# Altium project GarageBeamSafety.PrjPcb
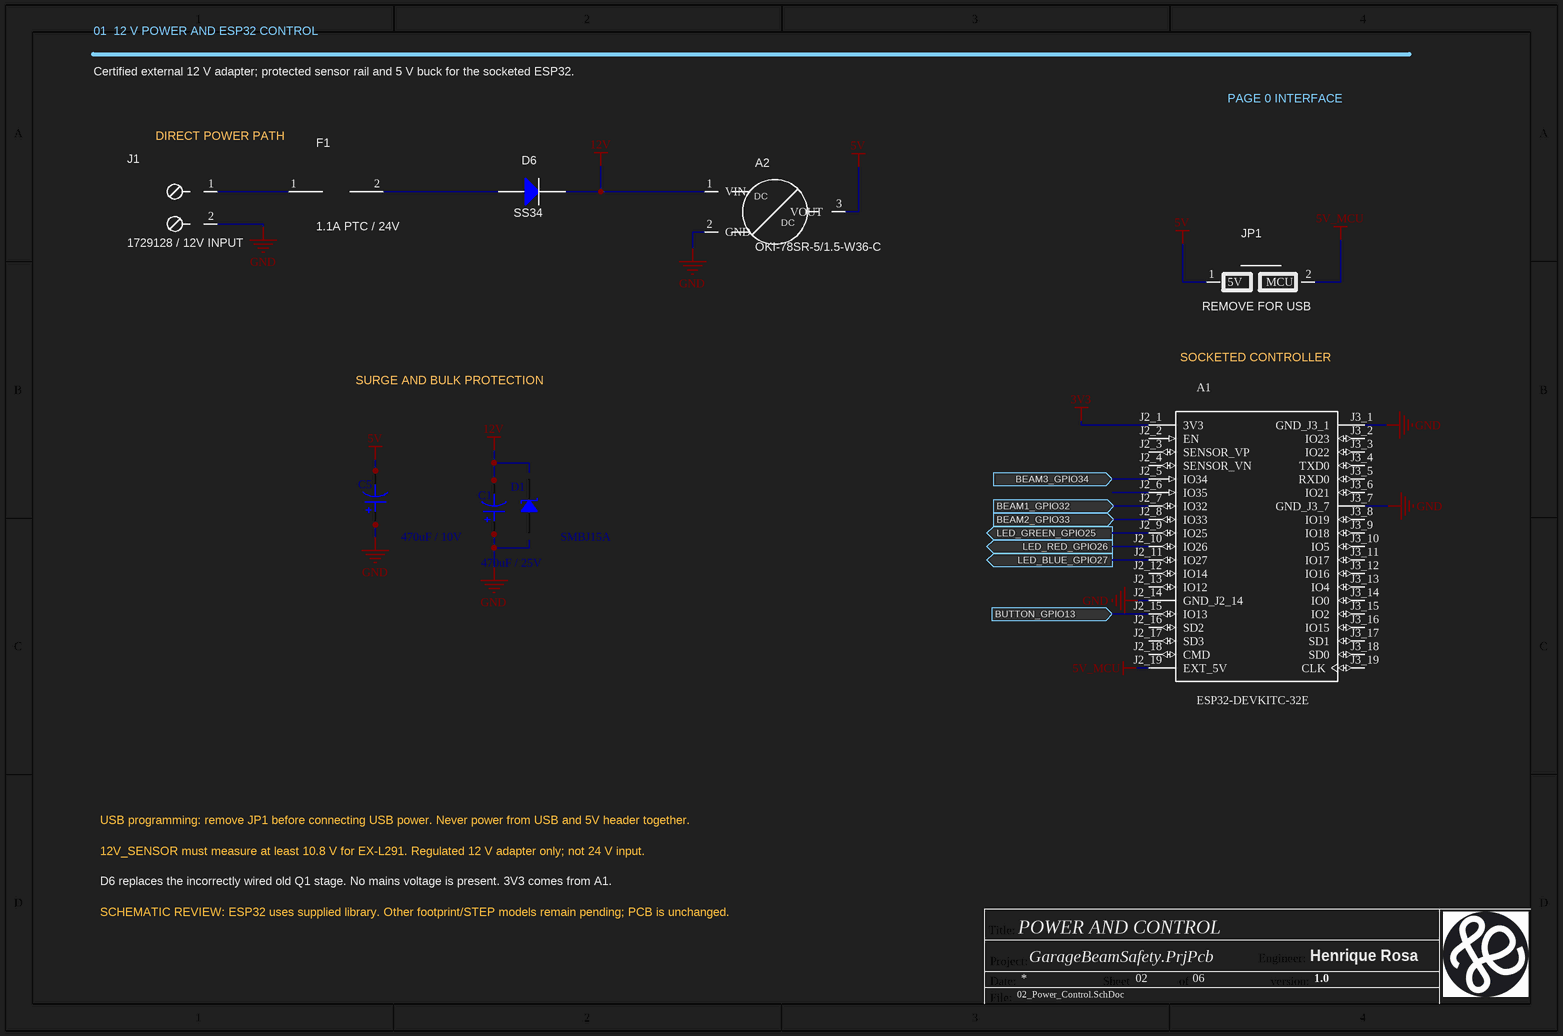
[diagram p0: 02_Power_Control.SchDoc]
4 sheets, 53 parts. Net scope: flat (ports and power ports of the same name join across sheets).
Board file: GarageBeamSafety.PcbDoc
Sheets:
  02_Power_Control.SchDoc
  01_System_Overview.SchDoc
    Designator = 03_Beam_Inputs.SchDoc
  05_Optical_Heads.SchDoc

## Sheet 02_Power_Control.SchDoc: POWER AND CONTROL
size A4; Author: Henrique Rosa; DrawnBy: Henq / Codex; Engineer: Henrique Rosa; Address1: rua; Address: Bairro; Address3: São Paulo, SP - Brasil; Address4: 55 (11) 9 6825-6715; DocumentNumber: GBS-01; Revision: 1.0; SheetNumber: 02; SheetTotal: 06; Site: henq.com; VersionControl_RevNumber: 03; PageSetup: Record=PageOptions|CenterHorizontal=True|CenterVertical=True|PrintScale=0.98|XCorrection=1.00|YCorrection=1.00|PrintKind=0|BorderSize=5000000|LeftOffset=0|BottomOffset=0|Orientation=2|PaperLength=1000|PaperWidth=1000|Scale=100|PaperSource=7|PrintQuality=-3|MediaType=1|DitherType=10|PrintScaleMode=1|PaperKind=A4|PaperIndex=9

### Parts
A1  ESP32-DEVKITC-32E  [MODULE_ESP32-DEVKITC-32E]
A2  OKI-78SR-5/1.5-W36-C  [MURATA_OKI78SR_VERTICAL]
C1  470uF / 25V  [PANASONIC_EEUFR1E471_D10_P5]
C5  470uF / 10V  [PANASONIC_EEUFR1A471_D8_P3_5]
D1  SMBJ15A  [SMBJ15A_A1_K2]
D6  SS34  [SS34_A1_K2]
F1  1.1A PTC / 24V  [BOURNS_MFMSMF110_24X_STYLE2]
J1  1729128 / 12V INPUT  [PHOENIX_1729128_MKDSN_2_508]
JP1  REMOVE FOR USB  [SAMTEC_TSW102_07_SINGLE]

### Ports
BEAM1_GPIO32 (in), BEAM2_GPIO33 (in), BEAM3_GPIO34 (in), BUTTON_GPIO13 (in), LED_BLUE_GPIO27 (out), LED_GREEN_GPIO25 (out), LED_RED_GPIO26 (out)

### Nets
3V3: A1.J2_1(3V3)
5V: A2.3(VOUT) C5.2 JP1.1(5V)
5V_MCU: A1.J2_19(EXT_5V) JP1.2(MCU)
12V: A2.1(VIN) C1.2 D6.2(K)
GND: A1.J2_14(GND_J2_14) A1.J3_1(GND_J3_1) A1.J3_7(GND_J3_7) A2.2(GND) C1.1 C5.1 J1.2(0V)
NetA1_J2_5: A1.J2_5(IO34) ; port BEAM3_GPIO34
NetA1_J2_7: A1.J2_7(IO32) ; port BEAM1_GPIO32
NetA1_J2_8: A1.J2_8(IO33) ; port BEAM2_GPIO33
NetA1_J2_9: A1.J2_9(IO25) ; port LED_GREEN_GPIO25
NetA1_J2_10: A1.J2_10(IO26) ; port LED_RED_GPIO26
NetA1_J2_11: A1.J2_11(IO27) ; port LED_BLUE_GPIO27
NetA1_J2_15: A1.J2_15(IO13) ; port BUTTON_GPIO13
NetD6_1: D6.1(A) F1.2
NetF1_1: F1.1 J1.1(+12V)

Not connected (* = marked no-connect by the designer): A1 J2_2(EN) J2_3(SENSOR_VP) J2_4(SENSOR_VN) J2_6(IO35) J2_12(IO14) J2_13(IO12) J2_16(SD2) J2_17(SD3) J2_18(CMD) J3_2(IO23) J3_3(IO22) J3_4(TXD0) J3_5(RXD0) J3_6(IO21) J3_8(IO19) J3_9(IO18) J3_10(IO5) J3_11(IO17) J3_12(IO16) J3_13(IO4) J3_14(IO0) J3_15(IO2) J3_16(IO15) J3_17(SD1) J3_18(SD0) J3_19(CLK); D1 1 2

### Notes on the sheet
- 01  12 V POWER AND ESP32 CONTROL
- Certified external 12 V adapter; protected sensor rail and 5 V buck for the socketed ESP32.
- PAGE 0 INTERFACE
- DIRECT POWER PATH
- SURGE AND BULK PROTECTION
- SOCKETED CONTROLLER
- USB programming: remove JP1 before connecting USB power. Never power from USB and 5V header together.
- 12V_SENSOR must measure at least 10.8 V for EX-L291. Regulated 12 V adapter only; not 24 V input.
- D6 replaces the incorrectly wired old Q1 stage. No mains voltage is present. 3V3 comes from A1.
- SCHEMATIC REVIEW: ESP32 uses supplied library. Other footprint/STEP models remain pending; PCB is unchanged.
- Title:
- Project:
- Date:
- Sheet
- of
- Engineer:
- version:
- File:
- Title
- Size:
- A4
- Number:
- Time:
- Revision:
- (in symbol *) DC

### Library data of the parts
A1 = ESP32-DEVKITC-32E: The ESP32-DEVKITC-32E transceiver evaluation board from Espressif Systems is a powerful development tool for wireless communication technologies. It supports 802.11 b/g/n Wi-Fi and BluetoothÂ® Smart Ready 4.x (BLE) dual-mode at 2.4GHz, making it ideal for; CAD status: Reusable reviewed symbol; pin/pad check performed by refresh. Native ERC, PCB ECO and 3D mechanical inspection still required.; Component refresh: 2026-09-10 sourced-symbol pass; not manufacturing release; Symbol adaptation: Keep existing part-specific symbol; package and procurement metadata retained.; SnapEDA_Link: https://www.snapeda.com/parts/ESP32-DEVKITC-32E/Espressif+Systems/view-part/?ref=snap; Package: None; Value: ESP32-DevKitC-32E; MF: Espressif Systems; MP: ESP32-DEVKITC-32E; Check_prices: https://www.snapeda.com/parts/ESP32-DEVKITC-32E/Espressif+Systems/view-part/?ref=eda; Manufacturer: Espressif Systems; Manufacturer Part Number: ESP32-DevKitC-32E; Part Number: ESP32-DevKitC-32E; Intended footprint: MODULE_ESP32-DEVKITC-32E
A2 = *: 12 V to regulated 5 V DC/DC module; Manufacturer: Murata; Populate: Yes; CAD status: Reusable reviewed symbol; pin/pad check performed by refresh. Native ERC, PCB ECO and 3D mechanical inspection still required.; Symbol provenance: Project-authored native Altium library; based on identified manufacturer part and pinout, not vendor-issued CAD; Component refresh: 2026-09-10 sourced-symbol pass; not manufacturing release; Symbol adaptation: Keep existing part-specific symbol; package and procurement metadata retained.; Manufacturer Part Number: OKI-78SR-5/1.5-W36-C; Package: SIP3_BUCK; Intended footprint: MURATA_OKI78SR_VERTICAL; Datasheet: https://www.murata.com/products/productdata/8807037992990/oki-78sr.pdf; Part Number: OKI-78SR-5/1.5-W36-C; Value: OKI-78SR-5/1.5-W36-C
C1 = Polarised Capacitor: SMT Polarised Capacitor; Part Number: EEU-FR1E471; Manufacturer: Panasonic; Polarity: Pin 1 positive; pin 2 negative; Symbol source: Celestial / SCH - PASSIVES - POLARISED CAPACITOR.SCHLIB / Polarised Capacitor; CAD status: Complete native symbol loaded; repair COPY requires visual and compiled connectivity validation; Valor: 470uF / 25V; Manufacturer Part Number: EEU-FR1E471; Intended footprint: PANASONIC_EEUFR1E471_D10_P5; Footprint source: Local PinRepairFootprints.PcbLib; source and polarity checked; Value: 470uF / 25V
C5 = Polarised Capacitor: SMT Polarised Capacitor; Part Number: EEU-FR1A471; Manufacturer: Panasonic; Polarity: Pin 1 positive; pin 2 negative; Symbol source: Celestial / SCH - PASSIVES - POLARISED CAPACITOR.SCHLIB / Polarised Capacitor; CAD status: Complete native symbol loaded; repair COPY requires visual and compiled connectivity validation; Valor: 470uF / 10V; Manufacturer Part Number: EEU-FR1A471; Intended footprint: PANASONIC_EEUFR1A471_D8_P3_5; Footprint source: Local PinRepairFootprints.PcbLib; source and polarity checked; Value: 470uF / 10V
D1 = DIODE TVS UNI: Rectifier Diode; Manufacturer: Littelfuse; Symbol source: Celestial / SCH - DIODES - DIODE TVS UNI.SCHLIB / DIODE TVS UNI; CAD status: Complete native symbol loaded; repair COPY requires visual and compiled connectivity validation; Value: SMBJ15A; Part Number: SMBJ15A; Manufacturer Part Number: SMBJ15A; Intended footprint: SMBJ15A_A1_K2; Footprint source: Local PinRepairFootprints.PcbLib; source and polarity checked
D6 = Diode: Series reverse-polarity Schottky diode; Manufacturer: Vishay; Value: SS34-E3/57T; Symbol source: Conventional symbol reused from ENERGY.SchDoc; CAD status: Reusable reviewed symbol; pin/pad check performed by refresh. Native ERC, PCB ECO and 3D mechanical inspection still required.; Component refresh: 2026-09-10 sourced-symbol pass; not manufacturing release; Symbol adaptation: Retain existing diode symbol for SS34; dedicated Schottky glyph remains a follow-up (not silently replaced with TVS/rectifier artwork).; Part Number: SS34-E3/57T; Manufacturer Part Number: SS34-E3/57T; Intended footprint: SS34_A1_K2; Footprint source: Local PinRepairFootprints.PcbLib; source and polarity checked
F1 = *: Resettable 12 V input fuse; Manufacturer: Bourns; Manufacturer Part Number: MF-MSMF110/24X-2; Populate: Yes; CAD status: Reusable reviewed symbol; pin/pad check performed by refresh. Native ERC, PCB ECO and 3D mechanical inspection still required.; Value: MF-MSMF110/24X-2; Component refresh: 2026-09-10 sourced-symbol pass; not manufacturing release; Symbol source: Celestial / Mark Harris / SCH - PASSIVES - THERMISTOR PTC.SCHLIB / Thermistor PTC; Symbol adaptation: Import Celestial symbol artwork; retain physical pin identities and positions; lead extensions adapt the symbol to existing wiring.; Package: F1812; Intended footprint: BOURNS_MFMSMF110_24X_STYLE2; Footprint source: Local PinRepairFootprints.PcbLib; source and polarity checked; Part Number: MF-MSMF110/24X-2; Voltage rating: 24 V
J1 = *: Two-position 5.08 mm screw terminal; Manufacturer: Phoenix Contact; Populate: Yes; CAD status: Reusable reviewed symbol; pin/pad check performed by refresh. Native ERC, PCB ECO and 3D mechanical inspection still required.; Symbol provenance: Project-authored native Altium library; based on identified manufacturer part and pinout, not vendor-issued CAD; Component refresh: 2026-09-10 sourced-symbol pass; not manufacturing release; Symbol adaptation: Keep existing part-specific symbol; package and procurement metadata retained.; Manufacturer Part Number: 1729128; Package: TERM_2_508; Intended footprint: PHOENIX_1729128_MKDSN_2_508; Part Number: 1729128; Value: 1729128
JP1 = *: External 5 V disconnect; fit shunt only without USB; Manufacturer: Samtec; Manufacturer Part Number: TSW-102-07-G-S; Populate: Yes; CAD status: Reusable reviewed symbol; pin/pad check performed by refresh. Native ERC, PCB ECO and 3D mechanical inspection still required.; Value: TSW-102-07-G-S; Component refresh: 2026-09-10 sourced-symbol pass; not manufacturing release; Symbol adaptation: Keep existing part-specific symbol; package and procurement metadata retained.; Package: HEADER_1X02_2.54; Intended footprint: SAMTEC_TSW102_07_SINGLE; Footprint source: Local PinRepairFootprints.PcbLib; source and polarity checked; Part Number: TSW-102-07-G-S

## Sheet 01_System_Overview.SchDoc: SYSTEM HIERARCHY
size A4; Author: Henrique Rosa; DrawnBy: Henq / Codex; Engineer: Henrique Rosa; Address1: rua; Address: Bairro; Address3: São Paulo, SP - Brasil; Address4: 55 (11) 9 6825-6715; DocumentNumber: GBS-00; Revision: A; SheetNumber: 01; SheetTotal: 06; Site: henq.com; VersionControl_RevNumber: 03; PageSetup: Record=PageOptions|CenterHorizontal=True|CenterVertical=True|PrintScale=0.98|XCorrection=1.00|YCorrection=1.00|PrintKind=0|BorderSize=5000000|LeftOffset=0|BottomOffset=0|Orientation=2|PaperLength=1000|PaperWidth=1000|Scale=100|PaperSource=7|PrintQuality=-3|MediaType=1|DitherType=10|PrintScaleMode=1|PaperKind=A4|PaperIndex=9
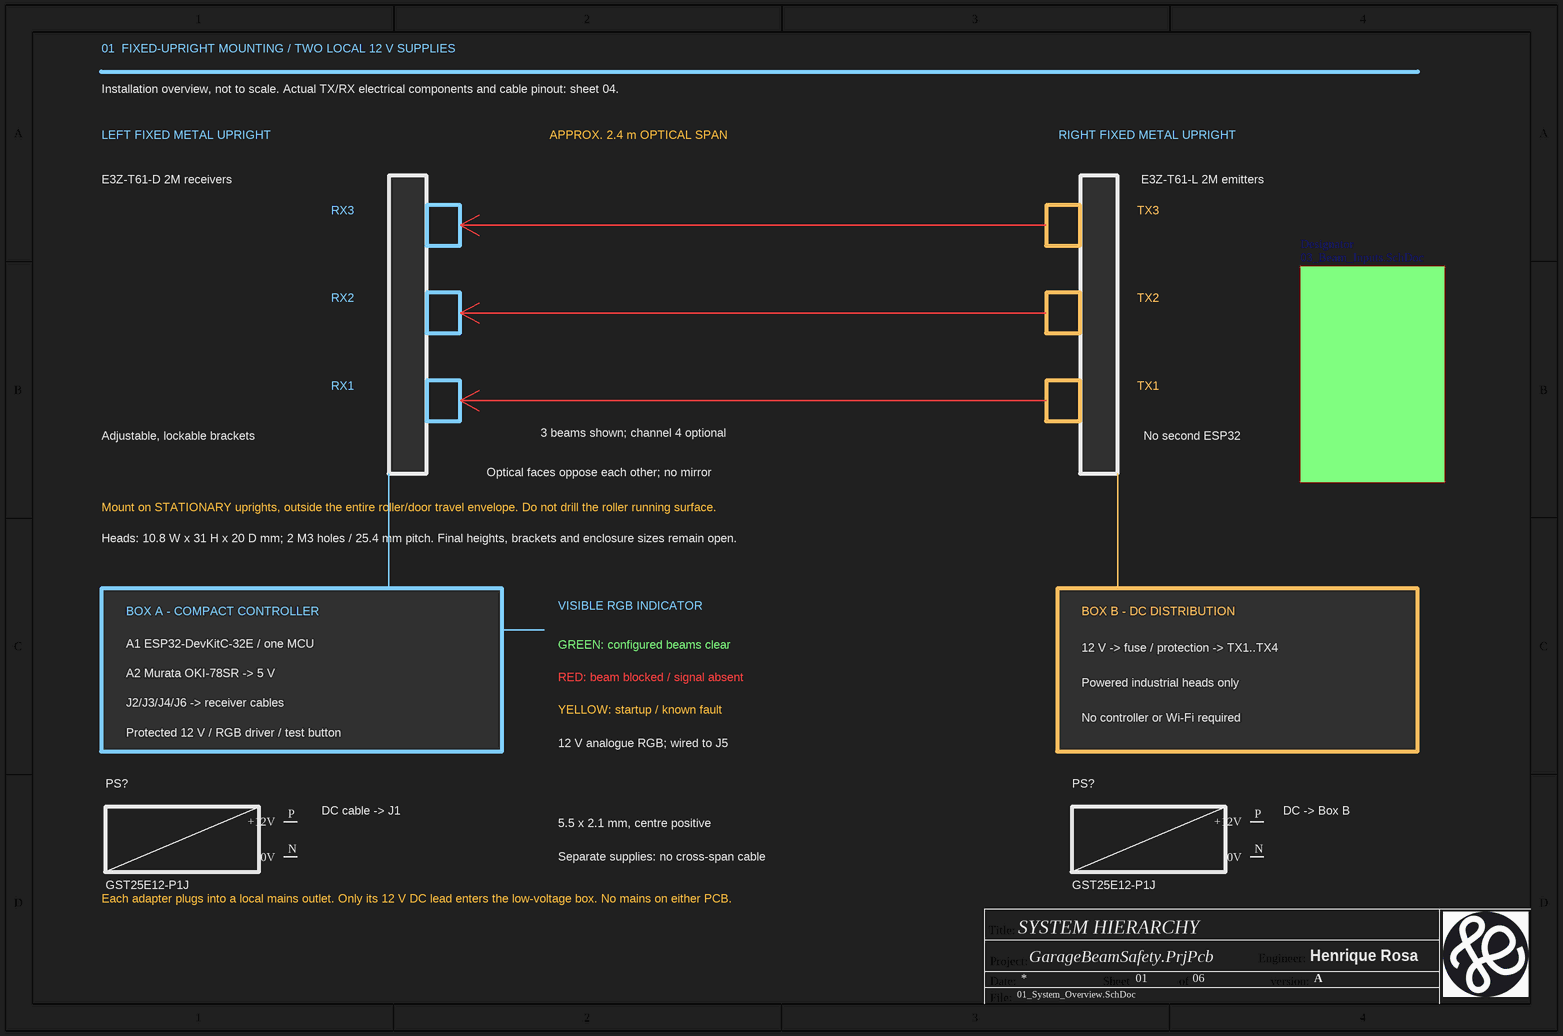
[diagram p1: 01_System_Overview.SchDoc]

### Parts
(Parts that share a designator on the sheet are numbered #1, #2 ... from top to bottom, then left to right.)
PS?#1  GST25E12-P1J  (graphical)
PS?#2  GST25E12-P1J  (graphical)

### Sub-sheets
Designator = 03_Beam_Inputs.SchDoc: no entries

### Nets

Not connected (* = marked no-connect by the designer): PS?#1 N(0V) P(+12V); PS?#2 N(0V) P(+12V)

### Notes on the sheet
- 01  FIXED-UPRIGHT MOUNTING / TWO LOCAL 12 V SUPPLIES
- Installation overview, not to scale. Actual TX/RX electrical components and cable pinout: sheet 04.
- LEFT FIXED METAL UPRIGHT
- APPROX. 2.4 m OPTICAL SPAN
- RIGHT FIXED METAL UPRIGHT
- E3Z-T61-D 2M receivers
- RX3
- TX3
- E3Z-T61-L 2M emitters
- RX2
- TX2
- Adjustable, lockable brackets
- RX1
- 3 beams shown; channel 4 optional
- TX1
- No second ESP32
- Mount on STATIONARY uprights, outside the entire roller/door travel envelope. Do not drill the roller running surface.
- Optical faces oppose each other; no mirror
- Heads: 10.8 W x 31 H x 20 D mm; 2 M3 holes / 25.4 mm pitch. Final heights, brackets and enclosure sizes remain open.
- BOX A - COMPACT CONTROLLER
- A1 ESP32-DevKitC-32E / one MCU
- VISIBLE RGB INDICATOR
- GREEN: configured beams clear
- BOX B - DC DISTRIBUTION
- 12 V -> fuse / protection -> TX1..TX4
- A2 Murata OKI-78SR -> 5 V
- J2/J3/J4/J6 -> receiver cables
- RED: beam blocked / signal absent
- YELLOW: startup / known fault
- Powered industrial heads only
- No controller or Wi-Fi required
- Protected 12 V / RGB driver / test button
- 12 V analogue RGB; wired to J5
- (near PS?#1) DC cable -> J1
- 5.5 x 2.1 mm, centre positive
- (near PS?#2) DC -> Box B
- (near PS?#1) Each adapter plugs into a local mains outlet. Only its 12 V DC lead enters the low-voltage box. No mains on either PCB.
- Separate supplies: no cross-span cable
- Title:
- Project:
- Date:
- Sheet
- of
- Engineer:
- version:
- File:
- Title
- Size:
- A4
- Number:
- Time:
- Revision:

### Library data of the parts
PS?#1 PS?#2 = *: Intact certified AC/DC adapter, 12 V 2.08 A; Manufacturer: MEAN WELL; Populate: Yes; Intended footprint: NONE - external plug-in adapter; CAD status: External equipment symbol: no controller-PCB pads; mechanical CAD remains unverified.; DC connector: 5.5 x 2.1 mm centre positive; keep adapter intact; Assembly location: External installation; not mounted on controller PCB; Procurement list: docs/PIN_REPAIR.html - external hardware; Component refresh: 2026-09-10 sourced-symbol pass; not manufacturing release; Symbol adaptation: Keep existing part-specific symbol; package and procurement metadata retained. External equipment: deliberately no PCB footprint. Manufacturer mechanical CAD remains separate/unverified.; Manufacturer Part Number: GST25E12-P1J; Package: EXTERNAL EQUIPMENT; Datasheet: https://www.meanwell.com/Upload/PDF/GST25E/GST25E-SPEC.PDF; Part Number: GST25E12-P1J; Value: GST25E12-P1J

## Sheet 03_Beam_Inputs.SchDoc: BEAM INPUTS
size A4; Author: Henrique Rosa; DrawnBy: Henq / Codex; Engineer: Henrique Rosa; Address1: rua; Address: Bairro; Address3: São Paulo, SP - Brasil; Address4: 55 (11) 9 6825-6715; DocumentNumber: GBS-02; Revision: A; SheetNumber: 03; SheetTotal: 06; Site: henq.com; VersionControl_RevNumber: 03; PageSetup: Record=PageOptions|CenterHorizontal=True|CenterVertical=True|PrintScale=0.98|XCorrection=1.00|YCorrection=1.00|PrintKind=0|BorderSize=5000000|LeftOffset=0|BottomOffset=0|Orientation=2|PaperLength=1000|PaperWidth=1000|Scale=100|PaperSource=7|PrintQuality=-3|MediaType=1|DitherType=10|PrintScaleMode=1|PaperKind=A4|PaperIndex=9
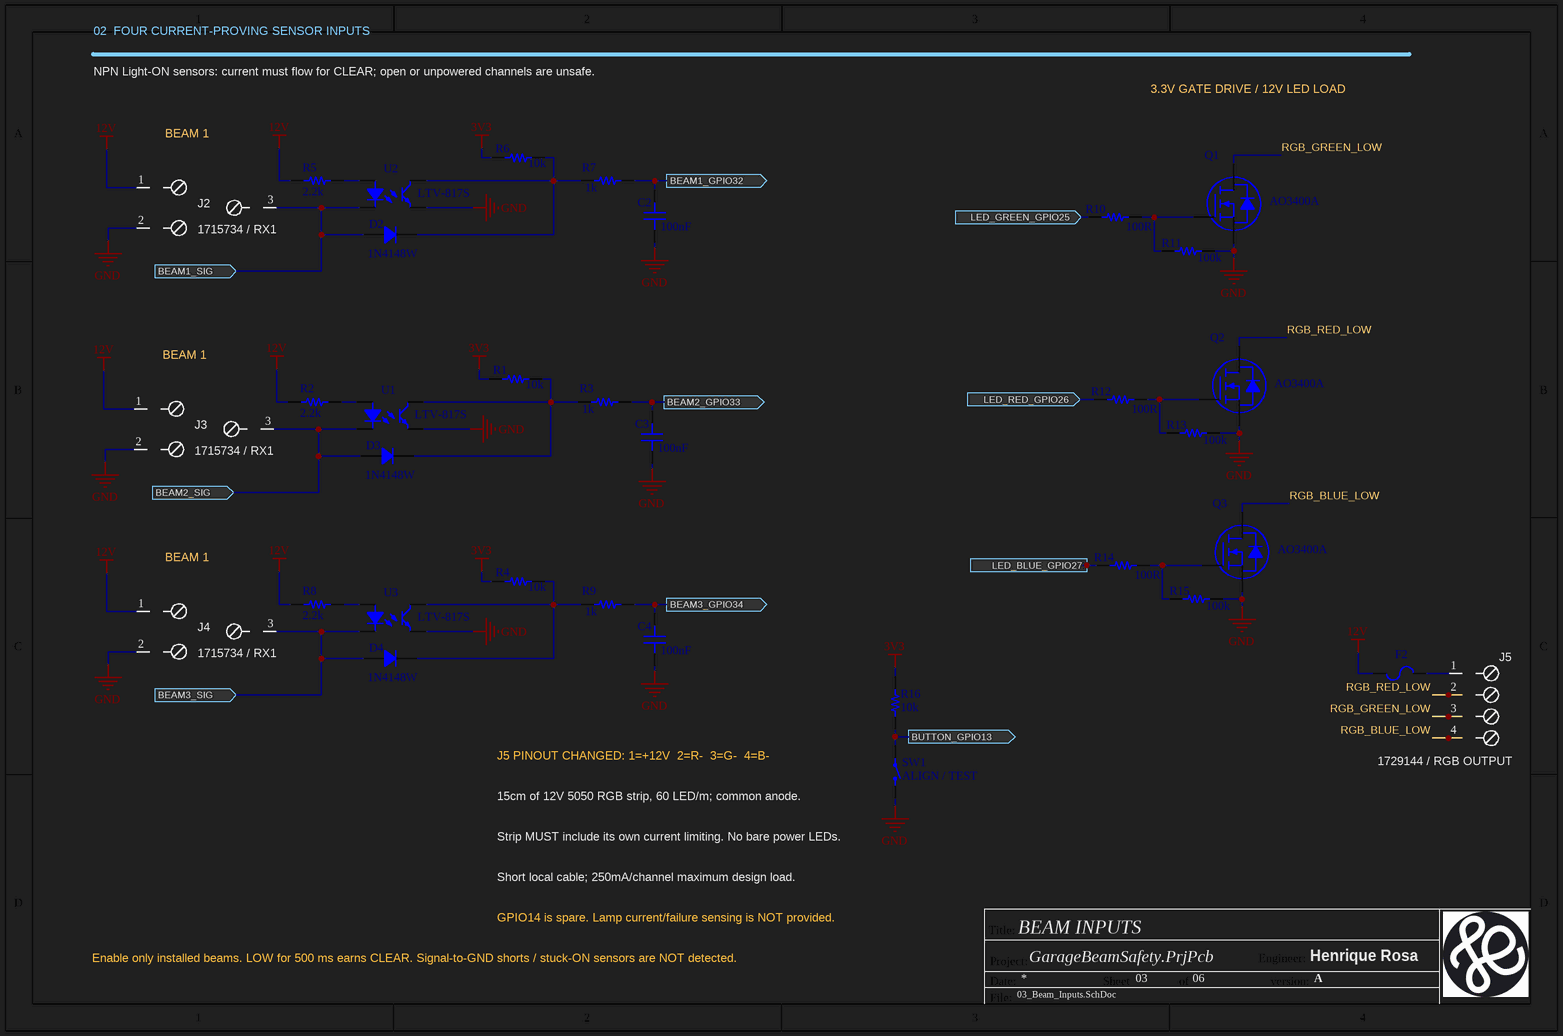
[diagram p2: 03_Beam_Inputs.SchDoc]

### Parts
C2  100nF  [MURATA GRM21B 0805_2012]
C3  100nF  [MURATA GRM21B 0805_2012]
C4  100nF  [MURATA GRM21B 0805_2012]
D2  1N4148W  [1N4148W_SOD123_A1_K2]
D3  1N4148W  [1N4148W_SOD123_A1_K2]
D4  1N4148W  [1N4148W_SOD123_A1_K2]
F2  0.5A FAST  [LITTELFUSE_0451_2410]  (value not drawn)
J2  1715734 / RX1  [PHOENIX_1715734_MKDS_3_508]
J3  1715734 / RX1  [PHOENIX_1715734_MKDS_3_508]
J4  1715734 / RX1  [PHOENIX_1715734_MKDS_3_508]
J5  1729144 / RGB OUTPUT  [PHOENIX_1729144_MKDSN_4_508]
Q1  AO3400A  [AO3400A_G1_S2_D3]
Q2  AO3400A  [AO3400A_G1_S2_D3]
Q3  AO3400A  [AO3400A_G1_S2_D3]
R1  10k  [YAGEO RES 0805_2012]
R2  2.2k  [YAGEO RES 0805_2012]
R3  1k  [YAGEO RES 0805_2012]
R4  10k  [YAGEO RES 0805_2012]
R5  2.2k  [YAGEO RES 0805_2012]
R6  10k  [YAGEO RES 0805_2012]
R7  1k  [YAGEO RES 0805_2012]
R8  2.2k  [YAGEO RES 0805_2012]
R9  1k  [YAGEO RES 0805_2012]
R10  100R  [YAGEO RES 0805_2012]
R11  100k  [YAGEO RES 0805_2012]
R12  100R  [YAGEO RES 0805_2012]
R13  100k  [YAGEO RES 0805_2012]
R14  100R  [YAGEO RES 0805_2012]
R15  100k  [YAGEO RES 0805_2012]
R16  10k  [YAGEO RES 0805_2012]
SW1  ALIGN / TEST  [OMRON_B3FS1000P_LOGICAL_1_2]
U1  LTV-817S  [LITEON LTV-817]
U2  LTV-817S  [LITEON LTV-817]
U3  LTV-817S  [LITEON LTV-817]

### Ports
BEAM1_GPIO32 (out), BEAM1_SIG (in), BEAM2_GPIO33 (out), BEAM2_SIG (in), BEAM3_GPIO34 (out), BEAM3_SIG (in), BUTTON_GPIO13 (out), LED_BLUE_GPIO27 (in), LED_GREEN_GPIO25 (in), LED_RED_GPIO26 (in)

### Nets
3V3: R1.1 R4.1 R6.1 R16.1
12V: F2.1 J2.1(+12V) J3.1(+12V) J4.1(+12V) R2.1 R5.1 R8.1
GND: C2.1 C3.1 C4.1 J2.2(0V) J3.2(0V) J4.2(0V) Q1.2(S) Q2.2(S) Q3.2(S) R11.2 R13.2 R15.2 SW1.2 U1.3 U2.3 U3.3
BEAM1_SIG: D2.1 J2.3(OUT) U2.2 ; port BEAM1_SIG
BEAM2_SIG: D3.1 J3.3(OUT) U1.2 ; port BEAM2_SIG
BEAM3_SIG: D4.1 J4.3(OUT) U3.2 ; port BEAM3_SIG
RGB_BLUE_LOW: J5.4(B-) Q3.3(D)
RGB_GREEN_LOW: J5.3(G-) Q1.3(D)
RGB_RED_LOW: J5.2(R-) Q2.3(D)
NetA1_J2_5: C4.2 R9.2 ; port BEAM3_GPIO34
NetA1_J2_7: C2.2 R7.2 ; port BEAM1_GPIO32
NetA1_J2_8: C3.2 R3.2 ; port BEAM2_GPIO33
NetA1_J2_9: R10.1 ; port LED_GREEN_GPIO25
NetA1_J2_10: R12.1 ; port LED_RED_GPIO26
NetA1_J2_11: R14.1 ; port LED_BLUE_GPIO27
NetA1_J2_15: R16.2 SW1.1 ; port BUTTON_GPIO13
NetD2_2: D2.2 R6.2 R7.1 U2.4
NetD3_2: D3.2 R1.2 R3.1 U1.4
NetD4_2: D4.2 R4.2 R9.1 U3.4
NetF2_2: F2.2 J5.1(+12V)
NetQ1_1: Q1.1(G) R10.2 R11.1
NetQ2_1: Q2.1(G) R12.2 R13.1
NetQ3_1: Q3.1(G) R14.2 R15.1
NetR2_2: R2.2 U1.1
NetR5_2: R5.2 U2.1
NetR8_2: R8.2 U3.1

### Notes on the sheet
- 02  FOUR CURRENT-PROVING SENSOR INPUTS
- NPN Light-ON sensors: current must flow for CLEAR; open or unpowered channels are unsafe.
- 3.3V GATE DRIVE / 12V LED LOAD
- (near J2) BEAM 1
- (near J3) BEAM 1
- (near J4) BEAM 1
- J5 PINOUT CHANGED: 1=+12V  2=R-  3=G-  4=B-
- 15cm of 12V 5050 RGB strip, 60 LED/m; common anode.
- (near SW1) Strip MUST include its own current limiting. No bare power LEDs.
- Short local cable; 250mA/channel maximum design load.
- GPIO14 is spare. Lamp current/failure sensing is NOT provided.
- Enable only installed beams. LOW for 500 ms earns CLEAR. Signal-to-GND shorts / stuck-ON sensors are NOT detected.
- Title:
- Project:
- Date:
- Sheet
- of
- Engineer:
- version:
- File:
- Title
- Size:
- A4
- Number:
- Time:
- Revision:

### Library data of the parts
C2-C4 = Capacitor: SMT Capacitor; Part Number: GRM21BR71H104KA01L; Manufacturer: Murata; Symbol source: Celestial / SCH - PASSIVES - CAPACITOR.SCHLIB / Capacitor; CAD status: Complete native symbol loaded; repair COPY requires visual and compiled connectivity validation; Valor: 100nF; Manufacturer Part Number: GRM21BR71H104KA01L; Intended footprint: MURATA GRM21B 0805_2012; Footprint source: Celestial Altium Library / Mark Harris / https://altiumlibrary.com; Value: 100nF
D2-D4 = Diode: Rectifier Diode; Manufacturer: Nexperia; Symbol source: Celestial / SCH - DIODES - DIODE.SCHLIB / Diode; CAD status: Complete native symbol loaded; repair COPY requires visual and compiled connectivity validation; Value: 1N4148W; Part Number: 1N4148W; Manufacturer Part Number: 1N4148W; Intended footprint: 1N4148W_SOD123_A1_K2; Footprint source: Local PinRepairFootprints.PcbLib; source and polarity checked
F2 = MOUNTED FUSE: GENERIC_fuse; Manufacturer: Littelfuse; Manufacturer Part Number: 0451.500MRL; Populate: Yes; Value: 0451.500MRL; Symbol source: Celestial / SCH - FUSE - MOUNTED FUSE.Schlib / MOUNTED FUSE; CAD status: Complete native symbol loaded; repair COPY requires visual and compiled connectivity validation; Package: FUSE_2410; Intended footprint: LITTELFUSE_0451_2410; Footprint source: Local PinRepairFootprints.PcbLib; source and polarity checked; Part Number: 0451.500MRL
J2-J4 = *: 12V / GND / NPN signal terminal; Manufacturer: Phoenix Contact; Populate: Yes; CAD status: Reusable reviewed symbol; pin/pad check performed by refresh. Native ERC, PCB ECO and 3D mechanical inspection still required.; Wiring: 1 brown +12V; 2 blue 0V; 3 black NPN output; Symbol provenance: Project-authored native Altium library; based on identified manufacturer part and pinout, not vendor-issued CAD; Component refresh: 2026-09-10 sourced-symbol pass; not manufacturing release; Symbol adaptation: Keep existing part-specific symbol; package and procurement metadata retained.; Manufacturer Part Number: 1715734; Package: MKDS 1,5/3-5,08; Intended footprint: PHOENIX_1715734_MKDS_3_508; Datasheet: https://www.phoenixcontact.com/en-us/products/printed-circuit-board-terminal-mkds-15-3-508-1715734; Part Number: 1715734; Value: 1715734
J5 = *: Common-anode analogue RGB strip; NOT addressable; Manufacturer: Phoenix Contact; Populate: Yes; CAD status: Reusable reviewed symbol; pin/pad check performed by refresh. Native ERC, PCB ECO and 3D mechanical inspection still required.; Symbol provenance: Project-authored native Altium library; based on identified manufacturer part and pinout, not vendor-issued CAD; Component refresh: 2026-09-10 sourced-symbol pass; not manufacturing release; Symbol adaptation: Keep existing part-specific symbol; package and procurement metadata retained.; Manufacturer Part Number: 1729144; Package: TERM_4_508; Intended footprint: PHOENIX_1729144_MKDSN_4_508; Part Number: 1729144; Value: 1729144
Q1-Q3 = MOSFET SINGLE GDS: Manufacturer: Alpha and Omega Semiconductor; Populate: Yes; 3D asset: lib/upstream-kicad/SOT-23.step; downloaded, native link pending; Symbol source: Celestial / SCH - FET - N-CH - MOSFET SINGLE GDS.SCHLIB / MOSFET SINGLE GDS; CAD status: Complete native symbol loaded; repair COPY requires visual and compiled connectivity validation; Manufacturer Part Number: AO3400A; Package: Package_TO_SOT_SMD:SOT-23; Intended footprint: AO3400A_G1_S2_D3; Datasheet: https://www.aosmd.com/sites/default/files/res/datasheets/AO3400A.pdf; Footprint source: Local PinRepairFootprints.PcbLib; source and polarity checked; Part Number: AO3400A; Value: AO3400A
R1 R4 R6 R16 = Resistor: SMT Resistor; Part number: RC0805FR-0710KL; Manufacturer: Yageo; Symbol source: Celestial / SCH - PASSIVES - RESISTOR.SCHLIB / Resistor; CAD status: Complete native symbol loaded; repair COPY requires visual and compiled connectivity validation; Valor: 10k; Manufacturer Part Number: RC0805FR-0710KL; Intended footprint: YAGEO RES 0805_2012; Footprint source: Celestial Altium Library / Mark Harris / https://altiumlibrary.com; Value: 10k
R2 R5 R8 = Resistor: SMT Resistor; Part number: RC0805FR-072K2L; Manufacturer: Yageo; Symbol source: Celestial / SCH - PASSIVES - RESISTOR.SCHLIB / Resistor; CAD status: Complete native symbol loaded; repair COPY requires visual and compiled connectivity validation; Valor: 2.2k; Manufacturer Part Number: RC0805FR-072K2L; Intended footprint: YAGEO RES 0805_2012; Footprint source: Celestial Altium Library / Mark Harris / https://altiumlibrary.com; Value: 2.2k
R3 R7 R9 = Resistor: SMT Resistor; Part number: RC0805FR-071KL; Manufacturer: Yageo; Symbol source: Celestial / SCH - PASSIVES - RESISTOR.SCHLIB / Resistor; CAD status: Complete native symbol loaded; repair COPY requires visual and compiled connectivity validation; Valor: 1k; Manufacturer Part Number: RC0805FR-071KL; Intended footprint: YAGEO RES 0805_2012; Footprint source: Celestial Altium Library / Mark Harris / https://altiumlibrary.com; Value: 1k
R10 R12 R14 = Resistor: SMT Resistor; Part number: RC0805FR-07100RL; Manufacturer: Yageo; Symbol source: Celestial / SCH - PASSIVES - RESISTOR.SCHLIB / Resistor; CAD status: Complete native symbol loaded; repair COPY requires visual and compiled connectivity validation; Valor: 100R; Manufacturer Part Number: RC0805FR-07100RL; Intended footprint: YAGEO RES 0805_2012; Footprint source: Celestial Altium Library / Mark Harris / https://altiumlibrary.com; Value: 100R
R11 R13 R15 = Resistor: SMT Resistor; Part number: RC0805FR-07100KL; Manufacturer: Yageo; Symbol source: Celestial / SCH - PASSIVES - RESISTOR.SCHLIB / Resistor; CAD status: Complete native symbol loaded; repair COPY requires visual and compiled connectivity validation; Valor: 100k; Manufacturer Part Number: RC0805FR-07100KL; Intended footprint: YAGEO RES 0805_2012; Footprint source: Celestial Altium Library / Mark Harris / https://altiumlibrary.com; Value: 100k
SW1 = SPST 2PIN: Manufacturer: Omron; Manufacturer Part Number: B3FS-1000P; Populate: Yes; Value: B3FS-1000P; Symbol source: Celestial / SCH - SWITCH - SPST 2PIN.SCHLIB / SPST 2PIN; CAD status: Complete native symbol loaded; repair COPY requires visual and compiled connectivity validation; Package: SW_SMD_6X6; Intended footprint: OMRON_B3FS1000P_LOGICAL_1_2; Footprint source: Local PinRepairFootprints.PcbLib; source and polarity checked; Part Number: B3FS-1000P
U1-U3 = Optoisolator: Manufacturer: Lite-On; Manufacturer Part Number: LTV-817S-TA1; Populate: Yes; Value: LTV-817S-TA1; Symbol source: Celestial / SCH - OPTOISOLATORS - OPTOISOLATOR.SCHLIB / Optoisolator; CAD status: Complete native symbol loaded; repair COPY requires visual and compiled connectivity validation; Package: SMD4; Intended footprint: LITEON LTV-817; Footprint source: Celestial Altium Library / Mark Harris / https://altiumlibrary.com; Valor: LTV-817S; Part Number: LTV-817S-TA1

## Sheet 05_Optical_Heads.SchDoc: External optical heads and cable wiring
size A4; Author: Henrique Rosa; DrawnBy: Henq / Codex; Engineer: Henrique Rosa; Address1: rua; Address: Bairro; Address3: São Paulo, SP - Brasil; Address4: 55 (11) 9 6825-6715; DocumentNumber: GBS-OPT-04; Revision: A; SheetNumber: 05; SheetTotal: 06; Site: henq.com; VersionControl_RevNumber: 03; PageSetup: Record=PageOptions|CenterHorizontal=True|CenterVertical=True|PrintScale=0.98|XCorrection=1.00|YCorrection=1.00|PrintKind=0|BorderSize=5000000|LeftOffset=0|BottomOffset=0|Orientation=2|PaperLength=1000|PaperWidth=1000|Scale=100|PaperSource=7|PrintQuality=-3|MediaType=1|DitherType=10|PrintScaleMode=1|PaperKind=A4|PaperIndex=9
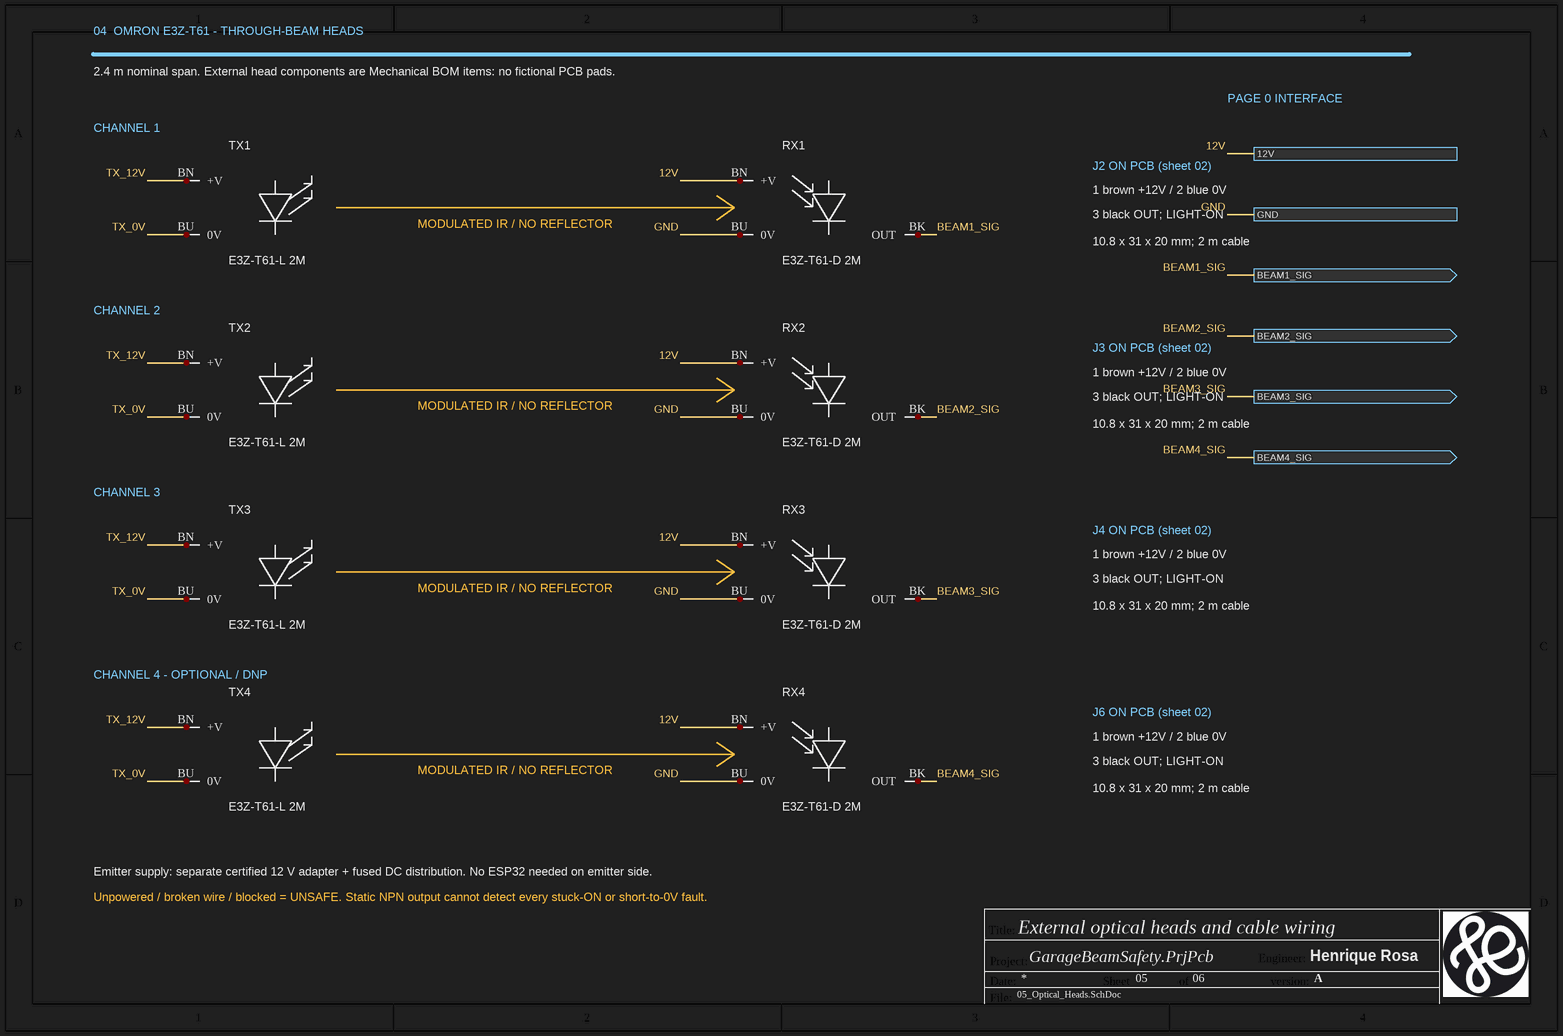
[diagram p3: 05_Optical_Heads.SchDoc]

### Parts
RX1  E3Z-T61-D 2M  (graphical)
RX2  E3Z-T61-D 2M  (graphical)
RX3  E3Z-T61-D 2M  (graphical)
RX4  E3Z-T61-D 2M  (graphical)
TX1  E3Z-T61-L 2M  (graphical)
TX2  E3Z-T61-L 2M  (graphical)
TX3  E3Z-T61-L 2M  (graphical)
TX4  E3Z-T61-L 2M  (graphical)

### Ports
12V, BEAM1_SIG (out), BEAM2_SIG (out), BEAM3_SIG (out), BEAM4_SIG (out), GND

### Nets
12V: RX1.BN(+V) RX2.BN(+V) RX3.BN(+V) RX4.BN(+V) ; port 12V
BEAM1_SIG: RX1.BK(OUT) ; port BEAM1_SIG
BEAM2_SIG: RX2.BK(OUT) ; port BEAM2_SIG
BEAM3_SIG: RX3.BK(OUT) ; port BEAM3_SIG
BEAM4_SIG: RX4.BK(OUT) ; port BEAM4_SIG
GND: RX1.BU(0V) RX2.BU(0V) RX3.BU(0V) RX4.BU(0V) ; port GND
TX_0V: TX1.BU(0V) TX2.BU(0V) TX3.BU(0V) TX4.BU(0V)
TX_12V: TX1.BN(+V) TX2.BN(+V) TX3.BN(+V) TX4.BN(+V)

### Notes on the sheet
- 04  OMRON E3Z-T61 - THROUGH-BEAM HEADS
- 2.4 m nominal span. External head components are Mechanical BOM items: no fictional PCB pads.
- PAGE 0 INTERFACE
- CHANNEL 1
- J2 ON PCB (sheet 02)
- MODULATED IR / NO REFLECTOR
- 1 brown +12V / 2 blue 0V
- 3 black OUT; LIGHT-ON
- 10.8 x 31 x 20 mm; 2 m cable
- CHANNEL 2
- J3 ON PCB (sheet 02)
- CHANNEL 3
- J4 ON PCB (sheet 02)
- CHANNEL 4 - OPTIONAL / DNP
- J6 ON PCB (sheet 02)
- Emitter supply: separate certified 12 V adapter + fused DC distribution. No ESP32 needed on emitter side.
- Unpowered / broken wire / blocked = UNSAFE. Static NPN output cannot detect every stuck-ON or short-to-0V fault.
- Title:
- Project:
- Date:
- Sheet
- of
- Engineer:
- version:
- File:
- Title
- Size:
- A4
- Number:
- Time:
- Revision:

### Library data of the parts
RX1-RX3 = *: RECEIVER / NPN LIGHT-ON; purchased in E3Z-T61 2M pair; frame-mounted, not PCB-mounted; Manufacturer: Omron; Populate: Yes; Intended footprint: NONE - external wired device; CAD status: External equipment symbol: no controller-PCB pads; mechanical CAD remains unverified.; Cable: Integral 2 m cable; BN brown +V / BU blue 0V / receiver BK black OUT; Supply: 12-24 VDC nominal; use regulated 12 V; BOM note: Buy one E3Z-T61 2M pair per TX/RX pair, not two pairs; Symbol representation: Complete powered photoelectric head; optical glyph is functional, not a bare discrete diode; Symbol provenance: Project-authored native Altium library; based on identified manufacturer part and pinout, not vendor-issued CAD; Assembly location: External installation; not mounted on controller PCB; Procurement list: docs/PIN_REPAIR.html - external hardware; Component refresh: 2026-09-10 sourced-symbol pass; not manufacturing release; Symbol adaptation: Keep existing part-specific symbol; package and procurement metadata retained. External equipment: deliberately no PCB footprint. Manufacturer mechanical CAD remains separate/unverified.; Manufacturer Part Number: E3Z-T61-D 2M; Package: EXTERNAL CABLED HEAD; Order as pair: E3Z-T61 2M; Body dimensions mm: 10.8 W x 31 H x 20 D; Mounting: Two M3 holes at 25.4 mm centres; optical face toward opposite upright; Datasheet: https://industrial.omron.eu/en/products/E3Z-T61-2M; 3D download: https://download.ia.omron.com/download/zip/ST/OEE/E3Z_T61/; Part Number: E3Z-T61-D 2M; Value: E3Z-T61-D 2M; Valor: E3Z-T61-D 2M
RX4 = *: RECEIVER / NPN LIGHT-ON; purchased in E3Z-T61 2M pair; frame-mounted, not PCB-mounted; Manufacturer: Omron; Populate: Optional channel 4; Intended footprint: NONE - external wired device; CAD status: External equipment symbol: no controller-PCB pads; mechanical CAD remains unverified.; Cable: Integral 2 m cable; BN brown +V / BU blue 0V / receiver BK black OUT; Supply: 12-24 VDC nominal; use regulated 12 V; BOM note: Buy one E3Z-T61 2M pair per TX/RX pair, not two pairs; Symbol representation: Complete powered photoelectric head; optical glyph is functional, not a bare discrete diode; Symbol provenance: Project-authored native Altium library; based on identified manufacturer part and pinout, not vendor-issued CAD; Assembly location: External installation; not mounted on controller PCB; Procurement list: docs/PIN_REPAIR.html - external hardware; Component refresh: 2026-09-10 sourced-symbol pass; not manufacturing release; Symbol adaptation: Keep existing part-specific symbol; package and procurement metadata retained. External equipment: deliberately no PCB footprint. Manufacturer mechanical CAD remains separate/unverified.; Manufacturer Part Number: E3Z-T61-D 2M; Package: EXTERNAL CABLED HEAD; Order as pair: E3Z-T61 2M; Body dimensions mm: 10.8 W x 31 H x 20 D; Mounting: Two M3 holes at 25.4 mm centres; optical face toward opposite upright; Datasheet: https://industrial.omron.eu/en/products/E3Z-T61-2M; 3D download: https://download.ia.omron.com/download/zip/ST/OEE/E3Z_T61/; Part Number: E3Z-T61-D 2M; Value: E3Z-T61-D 2M; Valor: E3Z-T61-D 2M
TX1-TX3 = *: EMITTER; purchased in E3Z-T61 2M pair; frame-mounted, not PCB-mounted; Manufacturer: Omron; Populate: Yes; Intended footprint: NONE - external wired device; CAD status: External equipment symbol: no controller-PCB pads; mechanical CAD remains unverified.; Cable: Integral 2 m cable; BN brown +V / BU blue 0V / receiver BK black OUT; Supply: 12-24 VDC nominal; use regulated 12 V; BOM note: Buy one E3Z-T61 2M pair per TX/RX pair, not two pairs; Symbol representation: Complete powered photoelectric head; optical glyph is functional, not a bare discrete diode; Symbol provenance: Project-authored native Altium library; based on identified manufacturer part and pinout, not vendor-issued CAD; Assembly location: External installation; not mounted on controller PCB; Procurement list: docs/PIN_REPAIR.html - external hardware; Component refresh: 2026-09-10 sourced-symbol pass; not manufacturing release; Symbol adaptation: Keep existing part-specific symbol; package and procurement metadata retained. External equipment: deliberately no PCB footprint. Manufacturer mechanical CAD remains separate/unverified.; Manufacturer Part Number: E3Z-T61-L 2M; Package: EXTERNAL CABLED HEAD; Order as pair: E3Z-T61 2M; Body dimensions mm: 10.8 W x 31 H x 20 D; Mounting: Two M3 holes at 25.4 mm centres; optical face toward opposite upright; Datasheet: https://industrial.omron.eu/en/products/E3Z-T61-2M; 3D download: https://download.ia.omron.com/download/zip/ST/OEE/E3Z_T61/; Part Number: E3Z-T61-L 2M; Value: E3Z-T61-L 2M
TX4 = *: EMITTER; purchased in E3Z-T61 2M pair; frame-mounted, not PCB-mounted; Manufacturer: Omron; Populate: Optional channel 4; Intended footprint: NONE - external wired device; CAD status: External equipment symbol: no controller-PCB pads; mechanical CAD remains unverified.; Cable: Integral 2 m cable; BN brown +V / BU blue 0V / receiver BK black OUT; Supply: 12-24 VDC nominal; use regulated 12 V; BOM note: Buy one E3Z-T61 2M pair per TX/RX pair, not two pairs; Symbol representation: Complete powered photoelectric head; optical glyph is functional, not a bare discrete diode; Symbol provenance: Project-authored native Altium library; based on identified manufacturer part and pinout, not vendor-issued CAD; Assembly location: External installation; not mounted on controller PCB; Procurement list: docs/PIN_REPAIR.html - external hardware; Component refresh: 2026-09-10 sourced-symbol pass; not manufacturing release; Symbol adaptation: Keep existing part-specific symbol; package and procurement metadata retained. External equipment: deliberately no PCB footprint. Manufacturer mechanical CAD remains separate/unverified.; Manufacturer Part Number: E3Z-T61-L 2M; Package: EXTERNAL CABLED HEAD; Order as pair: E3Z-T61 2M; Body dimensions mm: 10.8 W x 31 H x 20 D; Mounting: Two M3 holes at 25.4 mm centres; optical face toward opposite upright; Datasheet: https://industrial.omron.eu/en/products/E3Z-T61-2M; 3D download: https://download.ia.omron.com/download/zip/ST/OEE/E3Z_T61/; Part Number: E3Z-T61-L 2M; Value: E3Z-T61-L 2M

## Nets that join several sheets
3V3: 02_Power_Control (A1.J2_1), 03_Beam_Inputs (R1.1 R4.1 R6.1 R16.1)
12V: 02_Power_Control (A2.1 C1.2 D6.2), 03_Beam_Inputs (7 pins)
GND: 02_Power_Control (7 pins), 03_Beam_Inputs (16 pins)
BEAM1_SIG: 03_Beam_Inputs (D2.1 J2.3 U2.2), 05_Optical_Heads (RX1.BK)
BEAM2_SIG: 03_Beam_Inputs (D3.1 J3.3 U1.2), 05_Optical_Heads (RX2.BK)
BEAM3_SIG: 03_Beam_Inputs (D4.1 J4.3 U3.2), 05_Optical_Heads (RX3.BK)
NetA1_J2_5: 02_Power_Control (A1.J2_5), 03_Beam_Inputs (C4.2 R9.2)
NetA1_J2_7: 02_Power_Control (A1.J2_7), 03_Beam_Inputs (C2.2 R7.2)
NetA1_J2_8: 02_Power_Control (A1.J2_8), 03_Beam_Inputs (C3.2 R3.2)
NetA1_J2_9: 02_Power_Control (A1.J2_9), 03_Beam_Inputs (R10.1)
NetA1_J2_10: 02_Power_Control (A1.J2_10), 03_Beam_Inputs (R12.1)
NetA1_J2_11: 02_Power_Control (A1.J2_11), 03_Beam_Inputs (R14.1)
NetA1_J2_15: 02_Power_Control (A1.J2_15), 03_Beam_Inputs (R16.2 SW1.1)